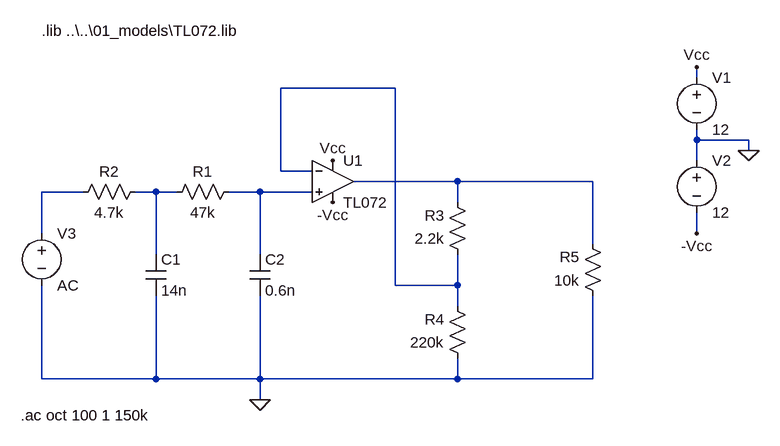
[diagram p0: schematic Butterworth_2nd.asc]
Butterworth_2nd.asc, the LTspice schematic file:
Version 4
SHEET 1 880 680
WIRE 688 0 688 -16
WIRE 224 16 48 16
WIRE 688 96 688 80
WIRE 768 96 688 96
WIRE 768 112 768 96
WIRE 688 128 688 96
WIRE 48 144 48 16
WIRE 96 144 48 144
WIRE 320 160 160 160
WIRE 528 160 320 160
WIRE -256 176 -320 176
WIRE -144 176 -176 176
WIRE -112 176 -144 176
WIRE 16 176 -32 176
WIRE 96 176 16 176
WIRE 320 192 320 160
WIRE -320 240 -320 176
WIRE 688 240 688 208
WIRE 528 256 528 160
WIRE -144 272 -144 176
WIRE 16 272 16 176
WIRE 224 320 224 16
WIRE 320 320 320 272
WIRE 320 320 224 320
WIRE 320 352 320 320
WIRE -320 464 -320 320
WIRE -144 464 -144 336
WIRE -144 464 -320 464
WIRE 16 464 16 336
WIRE 16 464 -144 464
WIRE 320 464 320 432
WIRE 320 464 16 464
WIRE 528 464 528 336
WIRE 528 464 320 464
WIRE 16 496 16 464
FLAG 16 496 0
FLAG 768 112 0
FLAG 688 -16 Vcc
FLAG 688 240 -Vcc
FLAG 128 128 Vcc
FLAG 128 192 -Vcc
SYMBOL res -16 160 R90
WINDOW 0 0 56 VBottom 2
WINDOW 3 32 56 VTop 2
SYMATTR InstName R1
SYMATTR Value 47k
SYMBOL res -160 160 R90
WINDOW 0 0 56 VBottom 2
WINDOW 3 32 56 VTop 2
SYMATTR InstName R2
SYMATTR Value 4.7k
SYMBOL res 336 288 R180
WINDOW 0 36 76 Left 2
WINDOW 3 36 40 Left 2
SYMATTR InstName R3
SYMATTR Value 2.2k
SYMBOL res 336 448 R180
WINDOW 0 36 76 Left 2
WINDOW 3 36 40 Left 2
SYMATTR InstName R4
SYMATTR Value 220k
SYMBOL res 544 352 R180
WINDOW 0 36 76 Left 2
WINDOW 3 36 40 Left 2
SYMATTR InstName R5
SYMATTR Value 10k
SYMBOL cap -160 272 R0
SYMATTR InstName C1
SYMATTR Value 14n
SYMBOL cap 0 272 R0
SYMATTR InstName C2
SYMATTR Value 0.6n
SYMBOL voltage 688 -16 R0
WINDOW 123 0 0 Left 2
WINDOW 39 0 0 Left 2
SYMATTR InstName V1
SYMATTR Value 12
SYMBOL voltage 688 112 R0
WINDOW 123 0 0 Left 2
WINDOW 39 0 0 Left 2
SYMATTR InstName V2
SYMATTR Value 12
SYMBOL voltage -320 224 R0
WINDOW 123 0 0 Left 2
WINDOW 39 0 0 Left 2
SYMATTR InstName V3
SYMATTR Value AC
SYMBOL Opamps\\opamp2 128 96 R0
SYMATTR InstName U1
SYMATTR Value TL072
TEXT -352 520 Left 2 !.ac oct 100 1 150k
TEXT -320 -72 Left 2 !.lib ..\\..\\01_models\\TL072.lib

The netlist it stands for:
* Butterworth_2nd.asc
R1 N005 N004 47k
R2 N004 N003 4.7k
R3 N001 N002 2.2k
R4 0 N001 220k
R5 0 N002 10k
C1 N004 0 14n
C2 N005 0 0.6n
V1 Vcc 0 12
V2 0 -Vcc 12
V3 N003 0 AC
XU1 N005 N001 Vcc -Vcc N002 TL072  ; pins In+ In- V+ V- OUT
.ac oct 100 1 150k
.lib ..\..\01_models\TL072.lib
.backanno
.end